# EAGLE design automator (EAGLE 4.16)
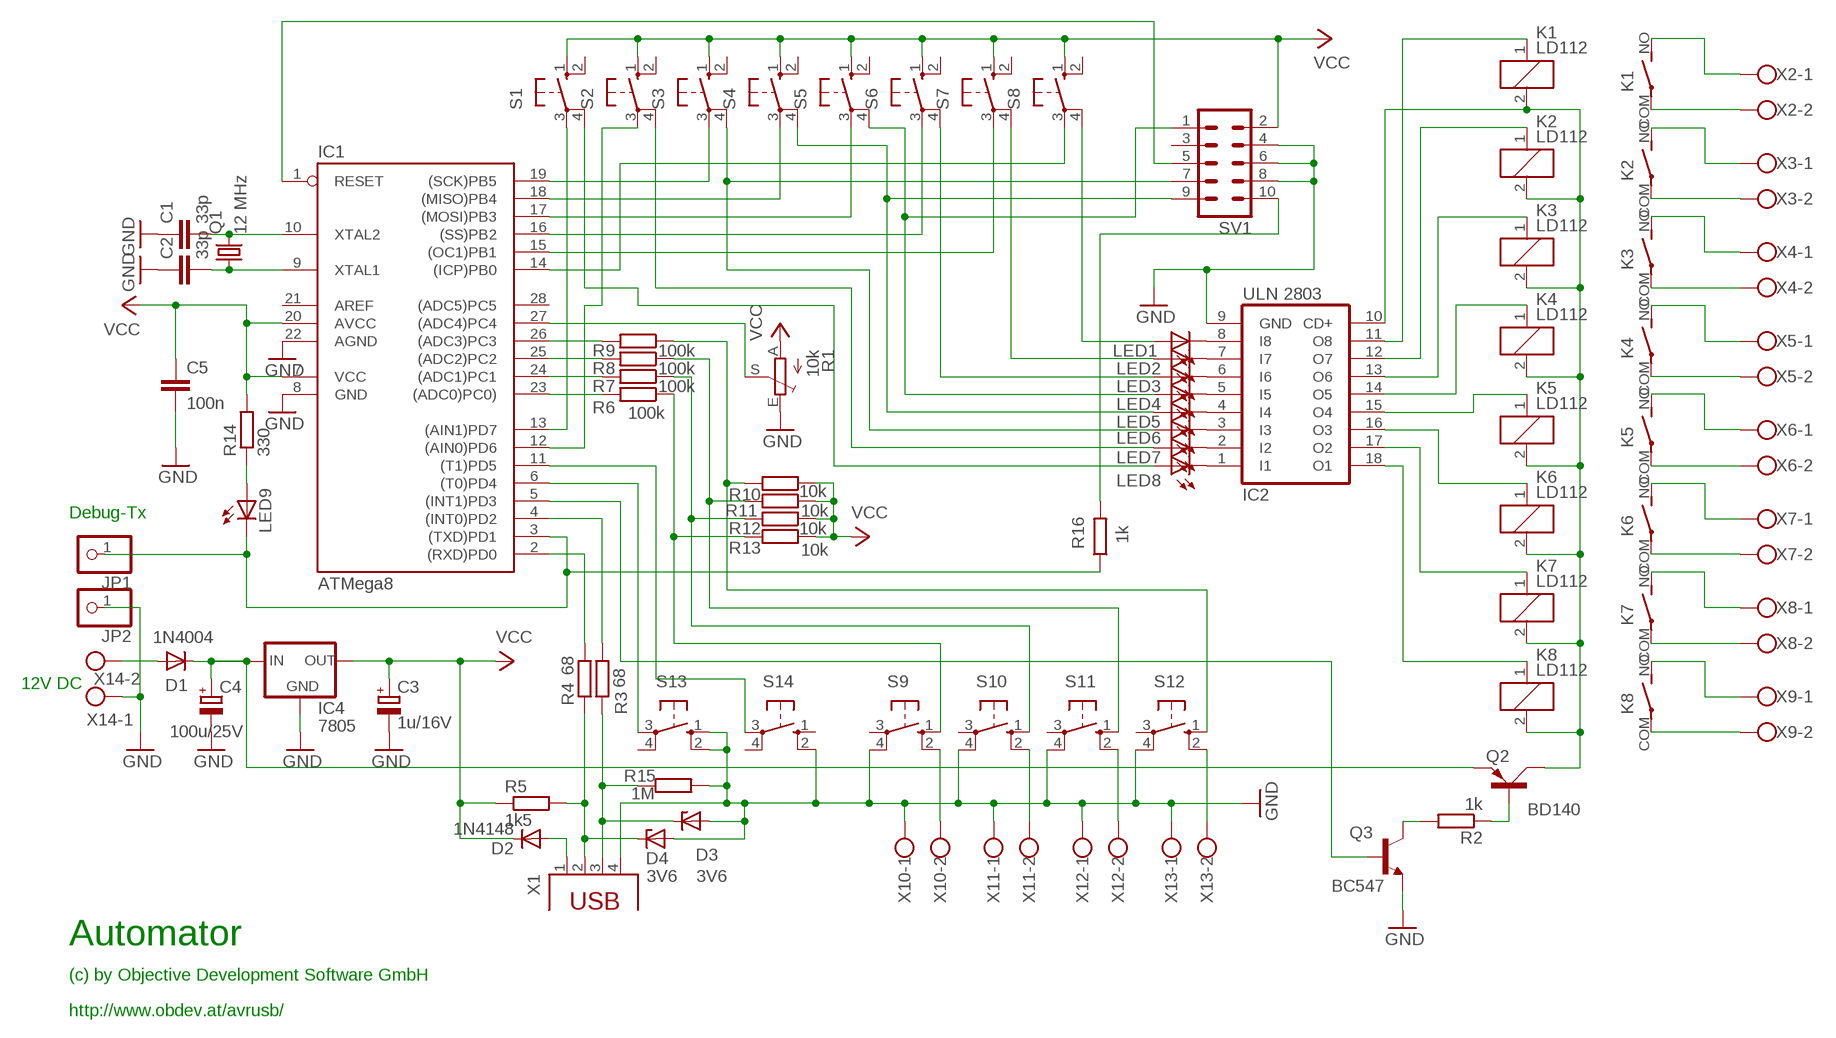
[diagram p0: schematic, sheet 1]

## Parts
C1  33p  C-EU025-024X044  [C025-024X044]
C2  33p  C-EU025-024X044  [C025-024X044]
C3  1u/16V  CPOL-EUE2.5-6  [E2,5-6]
C4  100u/25V  CPOL-EUE2.5-6  [E2,5-6]
C5  100n  C-EU050-025X075  [C050-025X075]
D1  1N4004  [DO41-10]
D2  1N4148  [DO35-10]
D3  3V6  ZENER-DIODEDO34-7  [DO34Z7]
D4  3V6  ZENER-DIODEDO34-7  [DO34Z7]
IC1  ATMega8  AT90S4433P  [DIL28-3]
IC2  ULN 2803  ULN2803A  [DIL18]
IC4  7805  78XXS  [78XXS]
JP1  PINHD-1X1  [1X01]
JP2  PINHD-1X1  [1X01]
K1  LD112  [LD]
K2  LD112  [LD]
K3  LD112  [LD]
K4  LD112  [LD]
K5  LD112  [LD]
K6  LD112  [LD]
K7  LD112  [LD]
K8  LD112  [LD]
LED1  LED3MM  [LED3MM]
LED2  LED3MM  [LED3MM]
LED3  LED3MM  [LED3MM]
LED4  LED3MM  [LED3MM]
LED5  LED3MM  [LED3MM]
LED6  LED3MM  [LED3MM]
LED7  LED3MM  [LED3MM]
LED8  LED3MM  [LED3MM]
LED9  LED3MM  [LED3MM]
Q1  12 MHz  CRYTALHC49S  [HC49/S]
Q2  BD140  [TO126AV]
Q3  BC547  [TO92]
R1  10k  TRIM_EU-CA6V  [CA6V]
R2  1k  R-EU_0207/10  [0207/10]
R3  68  R-EU_0207/10  [0207/10]
R4  68  R-EU_0207/10  [0207/10]
R5  1k5  R-EU_0207/10  [0207/10]
R6  100k  R-EU_0207/10  [0207/10]
R7  100k  R-EU_0207/10  [0207/10]
R8  100k  R-EU_0207/10  [0207/10]
R9  100k  R-EU_0207/10  [0207/10]
R10  10k  R-EU_0207/10  [0207/10]
R11  10k  R-EU_0207/10  [0207/10]
R12  10k  R-EU_0207/10  [0207/10]
R13  10k  R-EU_0207/10  [0207/10]
R14  330  R-EU_0207/10  [0207/10]
R15  1M  R-EU_0207/10  [0207/10]
R16  1k  R-EU_0207/10  [0207/10]
S1  10-XX  [B3F-10XX]
S2  10-XX  [B3F-10XX]
S3  10-XX  [B3F-10XX]
S4  10-XX  [B3F-10XX]
S5  10-XX  [B3F-10XX]
S6  10-XX  [B3F-10XX]
S7  10-XX  [B3F-10XX]
S8  10-XX  [B3F-10XX]
S9  10-XX  [B3F-10XX]
S10  10-XX  [B3F-10XX]
S11  10-XX  [B3F-10XX]
S12  10-XX  [B3F-10XX]
S13  10-XX  [B3F-10XX]
S14  10-XX  [B3F-10XX]
SV1  ML10  [ML10]
X1  PN61729  [PN61729]
X2  W237-102  [W237-102]
X3  W237-102  [W237-102]
X4  W237-102  [W237-102]
X5  W237-102  [W237-102]
X6  W237-102  [W237-102]
X7  W237-102  [W237-102]
X8  W237-102  [W237-102]
X9  W237-102  [W237-102]
X10  W237-102  [W237-102]
X11  W237-102  [W237-102]
X12  W237-102  [W237-102]
X13  W237-102  [W237-102]
X14  W237-102  [W237-102]

## Nets
GND: C1.1 C2.1 C3.- C4.- C5.2 D3.A D4.A IC1.8(GND) IC1.22(AGND) IC2.9(GND) IC4.GND JP2.1 Q3.1(E) R1.E R15.2 S9.4(P1) S10.4(P1) S11.4(P1) S12.4(P1) S13.1(S) S13.2(S1) S14.2(S1) SV1.4 SV1.6 SV1.8 X1.4 X10.1 X11.1 X12.1 X13.1 X14.1
N$1: C1.2 IC1.10(XTAL2) Q1.2
N$2: C2.2 IC1.9(XTAL1) Q1.1
N$3: D1.A X14.2
N$4: C4.+ D1.C IC4.IN Q2.E
N$5: LED8.A S1.4(P1)
N$6: IC1.27((ADC4)PC4) R1.S
N$7: LED7.A S2.4(P1)
N$8: LED6.A S3.4(P1) SV1.7
N$9: LED5.A S4.4(P1) SV1.9
N$10: IC1.13((AIN1)PD7) S1.3(P)
N$11: IC1.12((AIN0)PD6) S2.3(P)
N$12: IC1.19((SCK)PB5) S3.3(P)
N$13: IC1.18((MISO)PB4) S4.3(P)
N$14: IC2.8(I8) LED1.K(C)
N$15: IC2.7(I7) LED2.K(C)
N$16: IC2.6(I6) LED3.K(C)
N$17: IC2.5(I5) LED4.K(C)
N$18: IC2.4(I4) LED5.K(C)
N$19: IC2.3(I3) LED6.K(C)
N$20: IC2.2(I2) LED7.K(C)
N$21: IC2.1(I1) LED8.K(C)
N$22: IC1.17((MOSI)PB3) S5.3(P)
N$23: IC1.16((SS)PB2) S6.3(P)
N$24: IC1.15((OC1)PB1) S7.3(P)
N$25: IC1.14((ICP)PB0) S8.3(P)
N$26: LED4.A S5.4(P1) SV1.1
N$27: LED3.A S6.4(P1)
N$28: LED2.A S7.4(P1)
N$29: LED1.A S8.4(P1)
N$30: IC2.10(CD+) K1.2 K2.2 K3.2 K4.2 K5.2 K6.2 K7.2 K8.2 Q2.C
N$31: IC2.18(O1) K8.1
N$32: IC2.17(O2) K7.1
N$33: IC2.16(O3) K6.1
N$34: IC2.11(O8) K1.1
N$35: D2.A X1.1
N$36: IC2.12(O7) K2.1
N$37: IC2.13(O6) K3.1
N$38: IC2.14(O5) K4.1
N$39: Q3.3(C) R2.2
N$40: Q2.B R2.1
N$41: S9.2(S1) X10.2
N$42: S10.2(S1) X11.2
N$43: S11.2(S1) X12.2
N$44: S12.2(S1) X13.2
N$45: D4.C R4.1 R5.2 X1.2
N$46: D3.C R3.1 R15.1 X1.3
N$47: IC1.23((ADC0)PC0)) R6.2
N$48: IC1.2((RXD)PD0) R4.2
N$49: IC1.4((INT0)PD2) R3.2
N$50: IC1.24((ADC1)PC1) R7.2
N$51: IC1.25((ADC2)PC2) R8.2
N$52: IC1.26((ADC3)PC3) R9.2
N$53: R6.1 R13.2 S9.1(S)
N$54: R7.1 R12.2 S10.1(S)
N$55: R8.1 R11.2 S11.1(S)
N$56: R9.1 R10.2 S12.1(S)
N$57: IC1.3((TXD)PD1) JP1.1 LED9.K(C) R16.1
N$58: IC1.5((INT1)PD3) Q3.2(B)
N$59: IC1.6((T0)PD4) S13.3(P)
N$60: IC1.11((T1)PD5) S14.3(P)
N$61: LED9.A R14.1
N$62: K8.COM(2:P) X9.2
N$63: K7.COM(2:P) X8.2
N$64: K6.COM(2:P) X7.2
N$65: K5.COM(2:P) X6.2
N$66: K4.COM(2:P) X5.2
N$67: K3.COM(2:P) X4.2
N$68: K2.COM(2:P) X3.2
N$69: K1.COM(2:P) X2.2
N$70: K8.NO(2:S) X9.1
N$71: K7.NO(2:S) X8.1
N$72: K6.NO(2:S) X7.1
N$73: K5.NO(2:S) X6.1
N$74: K4.NO(2:S) X5.1
N$75: K3.NO(2:S) X4.1
N$76: K2.NO(2:S) X3.1
N$77: K1.NO(2:S) X2.1
N$78: IC2.15(O4) K5.1
N$81: IC1.1(RESET) SV1.5
N$83: R16.2 SV1.10
VCC: C3.+ C5.1 D2.C IC1.7(VCC) IC1.20(AVCC) IC4.OUT R1.A R5.1 R10.1 R11.1 R12.1 R13.1 R14.2 S1.1(S) S2.1(S) S3.1(S) S4.1(S) S5.1(S) S6.1(S) S7.1(S) S8.1(S) SV1.2
Unconnected: IC1.28((ADC5)PC5) S1.2(S1) S2.2(S1) S3.2(S1) S4.2(S1) S5.2(S1) S6.2(S1) S7.2(S1) S8.2(S1) S9.3(P) S10.3(P) S11.3(P) S12.3(P) S13.4(P1) S14.1(S) S14.4(P1) SV1.3

## Notes on the sheet
- Debug-Tx
- 12V DC
- Automator
- (c) by Objective Development Software GmbH
- http://www.obdev.at/avrusb/

## Power pins joined to a net without a drawn wire
AREF: IC1.21(AREF)

## Library data of the parts
C1 C2 C5 = rcl:C-EU: CAPACITOR, European symbol
C3 C4 = rcl:CPOL-EU: POLARIZED CAPACITOR, European symbol
D1 = diode:1N4004: DIODE general purpose rectifier, 1 A
D2 = diode:1N4148: DIODE high speed (Philips)
D3 D4 = diode:ZENER-DIODE: Z-Diode
IC1 = atmel:AT90S4433: MICROCONTROLLER 4 Kbytes FLASH 128 bytes SRAM 256 bytes EEPROM UART 6-channel 10 bit ADC
IC2 = uln-udn:ULN2803A: DRIVER ARRAY
IC4 = v-reg:78XXS: VOLTAGE REGULATOR
JP1 JP2 = pinhead:PINHD-1X1: PIN HEADER
K1-K8 = relay:LD?*: Slim Power Relay NAiS Source: http://www.mew-europe.com/.. en_ds_61112_0000.pdf
LED1-LED9 = led:LED: LED OSRAM: - CHIPLED LG R971, LG N971, LY N971, LG Q971, LY Q971, LO R971, LY R971 LH N974, LH R974 LS Q976, LO Q976, LY Q976 LO Q996 - Hyper CHIPLED LW Q18S LB Q993, LB Q99A, LB R99A - SideLED LS A670, LO A670, LY A670, LG A670, LP A670 LB A673, LV A673, LT A673, LW A673 LH A674 LY A675 LS A676, LA A676, LO A676, LY A676, LW A676 LS A679, LY A679, LG A679 - Hyper Micro SIDELED® LS Y876, LA Y876, LO Y876, LY Y876 LT Y87S - SmartLED LW L88C, LW L88S LB L89C, LB L89S, LG L890 LS L89K, LO L89K, LY L89K LS L896, LA L896, LO L896, LY L896 - TOPLED LS T670, LO T670, LY T670, LG T670, LP T670 LSG T670, LSP T670, LSY T670, LOP T670, LYG T670 LG T671, LOG T671, LSG T671 LB T673, LV T673, LT T673, LW T673 LH T674 LS T676, LA T676, LO T676, LY T676, LB T676, LH T676, LSB T676, LW T676 LB T67C, LV T67C, LT T67C, LS T67K, LO T67K, LY T67K, LW E67C LS E67B, LA E67B, LO E67B, LY E67B, LB E67C, LV E67C, LT E67C LW T67C LS T679, LY T679, LG T679 LS T770, LO T770, LY T770, LG T770, LP T770 LB T773, LV T773, LT T773, LW T773 LH T774 LS E675, LA E675, LY E675, LS T675 LS T776, LA T776, LO T776, LY T776, LB T776 LHGB T686 LT T68C, LB T68C - Hyper Mini TOPLED® LB M676 - Mini TOPLED Santana® LG M470 LS M47K, LO M47K, LY M47K Source: http://www.osram.convergy.de/
Q1 = crystal:CRYTAL: CRYSTAL
Q2 = transistor-power:BD140: PNP TRANSISTOR
Q3 = transistor-npn:BC547*: NPN Transistor
R1 = pot:TRIM_EU-: POTENTIOMETER
R2-R16 = rcl:R-EU_: RESISTOR, European symbol
S1-S14 = switch-omron:10-XX: OMRON SWITCH
SV1 = con-harting-ml:ML10: HARTING
X1 = con-berg:PN61729: BERG USB connector
X2-X14 = con-wago-500:W237-102: WAGO SCREW CLAMP

## Board
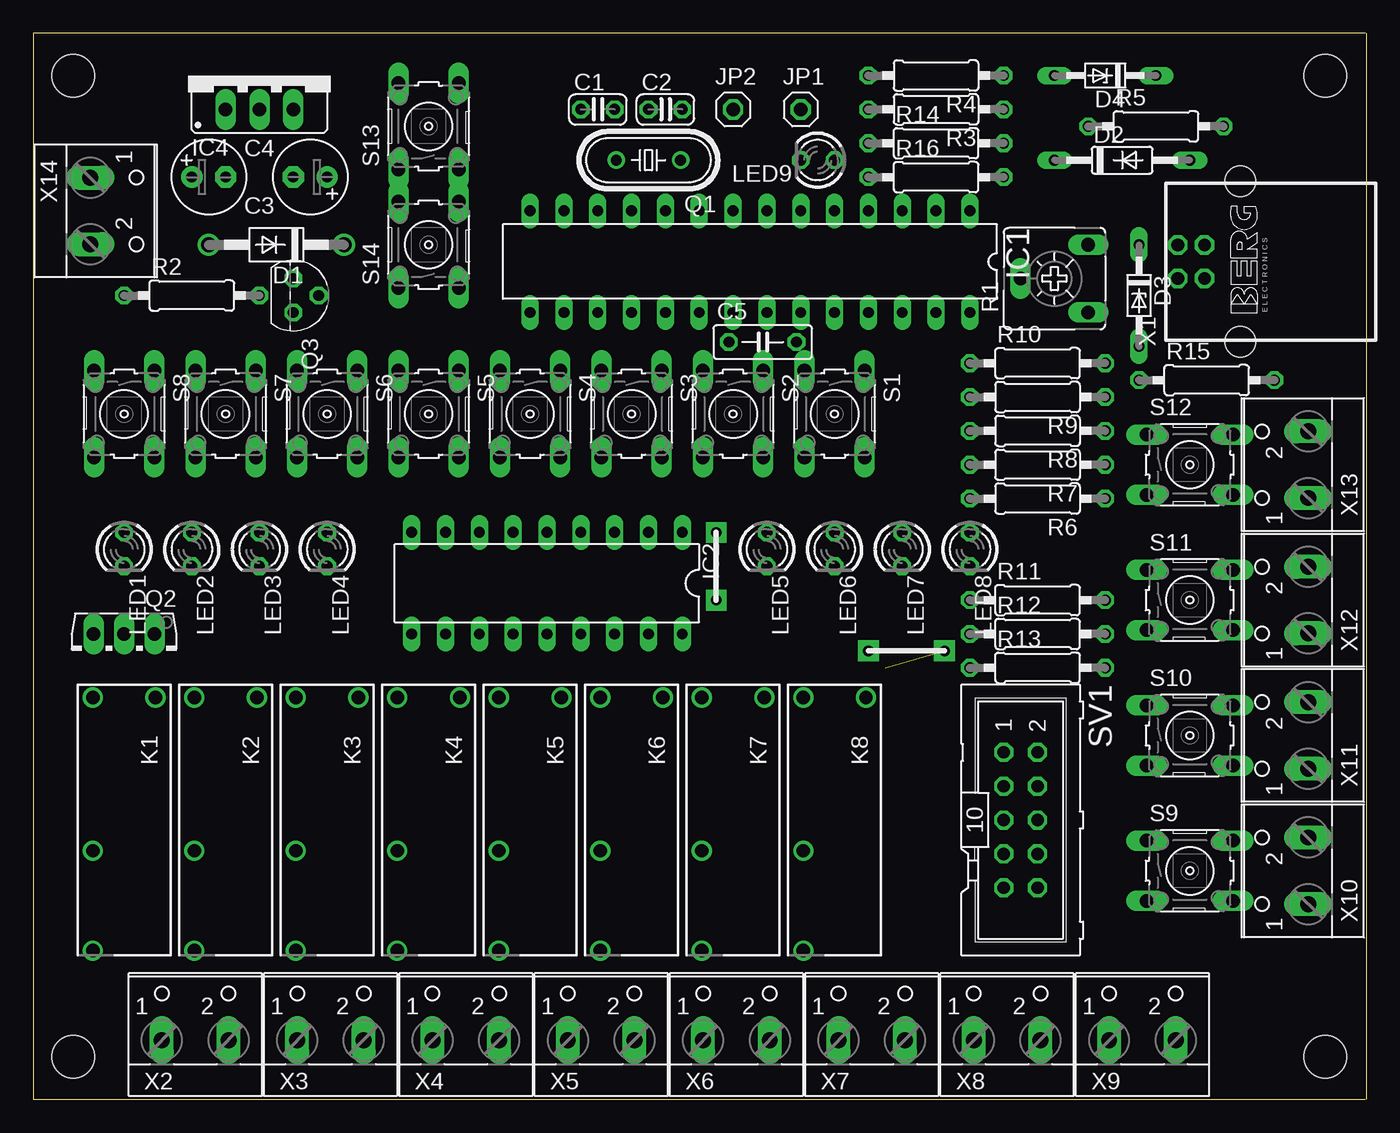
[diagram p1: board, top side]
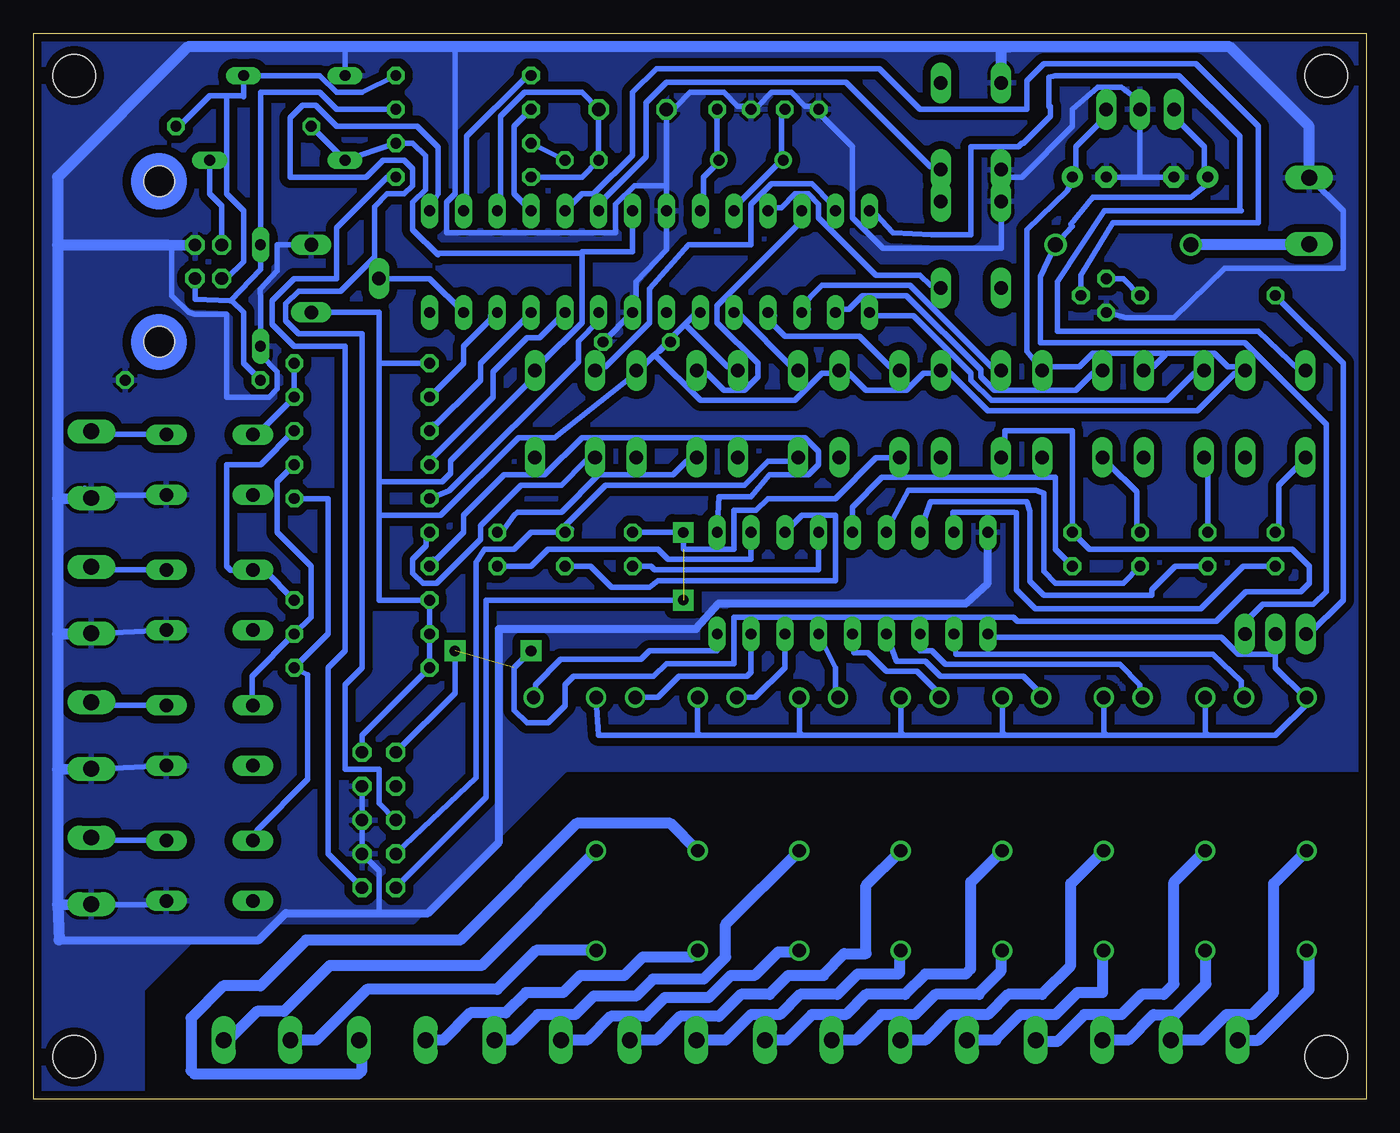
[diagram p2: board, bottom side, seen from below]

Size 100.08 x 80 mm. Coordinates in mm from the lower left corner, seen from the top.
Outline: 100,0 0,0 0,80 100,80
Outline: 100.08,80 100.08,0
Copper layers 16: Bottom 0.035mm
Design rules "default": minimum track width 16mil, minimum drill 31mil, track to track 8mil, track to pad 8mil, pad to pad 8mil, via to via 12mil, smd to smd 8mil, copper to edge 20mil, drill to drill 8mil, minimum pad ring 10mil, minimum via ring 15mil, stop-mask expansion 4mil, vias tented up to drill 0mil, thermal gap 10mil
Holes 3.2 mm at 3.01,3.17 96.99,3.17 96.99,76.83 3.01,76.83

### Footprints (pad centres in the part's own frame; a part is rotated, then mirrored left to right if it is on the bottom)
C025-024X044 = drill 0.813 octagon: 1 -1.27,0; 2 1.27,0
E2,5-6 = drill 0.813 pad 1.6 round: + -1.27,0 | drill 0.813 pad 1.6 octagon: - 1.27,0
C050-025X075 = drill 0.813 octagon: 1 -2.54,0; 2 2.54,0
DO41-10 = drill 1.118 round: A 5.08,0; C -5.08,0
DO35-10 = drill 0.813 long: A 5.08,0; C -5.08,0
DO34Z7 = drill 0.813 long: A 3.81,0; C -3.81,0
DIL28-3 = drill 0.813 long: 1 -16.51,-3.81; 2 -13.97,-3.81; 3 -11.43,-3.81; 4 -8.89,-3.81; 5 -6.35,-3.81; 6 -3.81,-3.81; 7 -1.27,-3.81; 8 1.27,-3.81; 9 3.81,-3.81; 10 6.35,-3.81; 11 8.89,-3.81; 12 11.43,-3.81; 13 13.97,-3.81; 14 16.51,-3.81; 15 16.51,3.81; 16 13.97,3.81; 17 11.43,3.81; 18 8.89,3.81; 19 6.35,3.81; 20 3.81,3.81; 21 1.27,3.81; 22 -1.27,3.81; 23 -3.81,3.81; 24 -6.35,3.81; 25 -8.89,3.81; 26 -11.43,3.81; 27 -13.97,3.81; 28 -16.51,3.81
DIL18 = drill 0.813 long: 1 -10.16,-3.81; 2 -7.62,-3.81; 3 -5.08,-3.81; 4 -2.54,-3.81; 5 0,-3.81; 6 2.54,-3.81; 7 5.08,-3.81; 8 7.62,-3.81; 9 10.16,-3.81; 10 10.16,3.81; 11 7.62,3.81; 12 5.08,3.81; 13 2.54,3.81; 14 0,3.81; 15 -2.54,3.81; 16 -5.08,3.81; 17 -7.62,3.81; 18 -10.16,3.81
78XXS = drill 1.016 long: GND 0,-2.54; IN -2.54,-2.54; OUT 2.54,-2.54
1X01 = drill 1.016 octagon: 1 0,0
LD = drill 1 round: 1 -9.2,2.35; 2 -9.2,-2.35; COM 2.3,-2.35; NO 9.8,-2.35
LED3MM = drill 0.813 octagon: A -1.27,0; K 1.27,0
HC49/S = drill 0.813 round: 1 -2.413,0; 2 2.413,0
TO126AV = drill 1.016 long: B 2.286,-1.27; C 0,-1.27; E -2.286,-1.27
TO92 = drill 0.813 octagon: 1 1.27,0; 2 0,1.905; 3 -1.27,0
CA6V = drill 1.016 long: A -2.54,-2.54; E 2.54,-2.54; S 0,2.54
0207/10 = drill 0.813 octagon: 1 -5.08,0; 2 5.08,0
B3F-10XX = drill 1.016 long: 1 -3.251,2.261; 2 3.251,2.261; 3 -3.251,-2.261; 4 3.251,-2.261
ML10 = drill 0.914 octagon: 1 -5.08,-1.27; 2 -5.08,1.27; 3 -2.54,-1.27; 4 -2.54,1.27; 5 0,-1.27; 6 0,1.27; 7 2.54,-1.27; 8 2.54,1.27; 9 5.08,-1.27; 10 5.08,1.27
PN61729 = drill 0.95 octagon: 1 1.25,4.71; 2 -1.25,4.71; 3 -1.25,2.71; 4 1.25,2.71 | hole 2.3: -6.02,0; 6.02,0
W237-102 = drill 1.194 long: 1 -2.5,-1.27; 2 2.5,-1.27

### Placement (x,y rotation side)
C1  42.38,74.29 0 top
C2  47.46,74.29 0 top
C3  20.79,69.21 180 top
C4  13.17,69.21 0 top
C5  54.76,56.83 0 top
D1  18.25,64.13 180 top
D2  81.75,70.48 0 top
D3  83.02,60.32 270 top
D4  80.48,76.83 180 top
IC1  53.81,62.86 180 top
IC2  38.57,38.73 180 top
IC4  16.98,76.83 0 top
JP1  57.62,74.29 0 top
JP2  52.54,74.29 0 top
K1  6.82,20.95 270 top
K2  14.44,20.95 270 top
K3  22.06,20.95 270 top
K4  29.68,20.95 270 top
K5  37.3,20.95 270 top
K6  44.92,20.95 270 top
K7  52.54,20.95 270 top
K8  60.16,20.95 270 top
LED1  6.82,41.27 270 top
LED2  11.9,41.27 270 top
LED3  16.98,41.27 270 top
LED4  22.06,41.27 270 top
LED5  55.08,41.27 270 top
LED6  60.16,41.27 270 top
LED7  65.24,41.27 270 top
LED8  70.32,41.27 270 top
LED9  58.89,70.48 180 top
Q1  46.19,70.48 180 top
Q2  6.82,33.65 180 top
Q3  19.52,60.32 270 top
R1  76.67,61.59 90 top
R2  11.9,60.32 0 top
R3  67.78,74.29 180 top
R4  67.78,76.83 180 top
R5  84.29,73.02 0 top
R6  75.4,45.08 180 top
R7  75.4,47.62 180 top
R8  75.4,50.16 180 top
R9  75.4,52.7 180 top
R10  75.4,55.24 0 top
R11  75.4,37.46 0 top
R12  75.4,34.92 0 top
R13  75.4,32.38 0 top
R14  67.78,71.75 0 top
R15  88.1,53.97 0 top
R16  67.78,69.21 0 top
S1  60.16,51.43 270 top
S2  52.54,51.43 270 top
S3  44.92,51.43 270 top
S4  37.3,51.43 270 top
S5  29.68,51.43 270 top
S6  22.06,51.43 270 top
S7  14.44,51.43 270 top
S8  6.82,51.43 270 top
S9  86.83,17.14 0 top
S10  86.83,27.3 0 top
S11  86.83,37.46 0 top
S12  86.83,47.62 0 top
S13  29.68,73.02 90 top
S14  29.68,64.13 90 top
SV1  74.13,20.95 270 top
X1  90.64,62.86 90 top
X2  12.15,5.71 0 top
X3  22.31,5.71 0 top
X4  32.47,5.71 0 top
X5  42.63,5.71 0 top
X6  52.79,5.71 0 top
X7  62.95,5.71 0 top
X8  73.11,5.71 0 top
X9  83.27,5.71 0 top
X10  94.45,17.14 90 top
X11  94.45,27.3 90 top
X12  94.45,37.46 90 top
X13  94.45,47.62 90 top
X14  5.55,66.67 270 top

### Tracks (layer width: path | path; a pad name or v marks a point on that pad's centre or on a via)
GND
  Bottom 0.406: 16.98,69.21 C4.- | 16.98,69.21 C3.- | 16.98,69.21 IC4.GND 16.47,74.54 18.38,75.94 20.15,75.94 22.06,74.29 22.06,73.02 25.87,69.21 27.14,69.21 | S12.4 90.64,45.33 94.96,45.33 X13.1 96.23,45.84 | X10.1 94.96,14.6 90.64,14.6 S9.4 | 27.14,69.21 27.39,68.96 27.39,63.88 36.28,63.88 38.57,66.16 38.57,71.5 40.86,73.78 C1.1 41.62,74.54 42.13,74.54 43.14,75.56 44.67,75.56 45.68,74.54 C2.1 46.7,74.54 47.21,74.54 48.22,75.56 50.76,75.56 51.78,74.54 JP2.1 52.54,68.57 | S13.1 27.42,69.49 27.14,69.21 | S14.2 27.42,68.93 27.14,69.21 | C5.2 IC1.22 54.83,59.56 54.83,61.34 52.54,63.75 IC1.8 52.54,68.57 | Q3.1 18,58.67 14.44,58.67 10.63,62.35 1.74,62.35 1.74,66.67 4.28,69.21 | 52.54,68.57 54.95,68.57 56.35,67.18 56.35,65.02 69.05,65.02 69.05,67.3 68.41,67.94 68.41,78.99 | X11.1 95.72,24.76 S10.4 | X12.1 95.72,34.92 S11.4 | R1.E 81.75,64.13 81.75,62.16 83.05,60.8 83.02,60 D3.A 83.02,55.88 81.75,54.61 81.75,53.34 82.39,52.7 85.56,52.7 85.56,58.92 87.97,58.92 88.42,59.05 89.69,60.32 89.69,63.81 90,64.13 90,64.11 | 76.67,79.05 76.67,78.99 D4.A | SV1.6 SV1.8 74.13,17.14 74.13,13.97 | SV1.6 SV1.4 SV1.6
  Bottom 0.61: 98.13,11.93 83.15,11.93 81.11,13.97 74.13,13.97 70.45,13.97 65.11,19.3 65.11,35.3 50.32,35.3 48.6,37.21 30.06,37.21 28.41,38.73 IC2.9
  Bottom 0.813: X14.1 4.28,69.21 4.28,73.02 10.25,78.99 26.76,78.99 | 26.76,78.99 68.41,78.99 76.67,78.99 88.48,78.99 98.26,69.21 98.26,64.13 | S13.2 27.42,78.84 26.76,78.99 | 98.26,14.6 X10.1 | 98.26,64.13 98.26,45.08 | 98.26,45.08 98.26,34.92 | 98.26,34.92 98.26,24.76 | 98.26,24.76 98.26,14.6 | 98.26,64.13 90,64.11 X1.4 | 98.26,24.76 X11.1 | 98.26,34.92 95.72,34.92 | 98.26,45.08 X13.1 | 98.26,14.6 98.13,11.93
  pour Bottom (isolate 0.61): 0.47,79.37 99.53,79.37 99.53,0.63 91.91,0.63 91.91,8.25 88.1,12.06 83.02,12.06 81.75,13.33 71.59,13.33 70.32,14.6 60.16,24.76 0.47,24.76
N$1
  Bottom 0.406: C1.2 43.9,73.78 43.9,70.99 Q1.2 44.16,70.23 47.21,67.18 IC1.10
N$2
  Bottom 0.406: C2.2 48.73,70.99 Q1.1 48.98,69.97 49.75,69.21 49.75,67.18 IC1.9
N$3
  Bottom 0.406: X14.2 5.04,64.13
  Bottom 0.813: 5.04,64.13 D1.A
N$4
  Bottom 0.406: IC4.IN 14.19,73.53 12.15,71.5 12.15,69.97 C4.+ 11.9,68.7 13.17,67.69 20.54,67.69 22.19,65.65 22.06,65.53 D1.C 24.47,61.72 24.47,56.76 9.11,56.76 3.01,50.67 3.01,38.73 | 3.01,38.73 3.01,38.22 | Q2.E 9.04,34.98 9.04,35.87 7.77,37.14 3.96,37.14 3.01,38.1 3.01,38.73
N$5
  Bottom 0.406: LED8.A 70.57,42.03 70.57,41.52 71.59,40.51 71.59,39.49 70.83,38.73 69.81,38.73 66.51,42.03 66.51,43.05 63.46,46.1 60.41,46.1 58.64,47.87 S1.4
N$6
  Bottom 0.406: R1.S 70.32,61.59 IC1.27
N$7
  Bottom 0.406: LED7.A 64.73,42.79 63.97,43.81 63.72,44.06 60.41,44.06 57.62,46.86 52.03,46.86 51.02,47.87 S2.4
N$8
  Bottom 0.406: S3.4 43.4,47.87 44.92,47.87 46.7,46.1 57.11,46.1 60.41,42.79 59.65,42.79 LED6.A 62.7,42.54 63.97,41.27 66.19,41.27 66.83,40.32 66.83,24.12 SV1.7
N$9  (1 unrouted)
  Bottom 0.406: LED5.A 51.27,42.54 51.27,41.27 47.46,41.27 47.46,44.19 45.81,44.19 44.92,45.08 39.84,45.08 36.79,48.13 35.09,48.13 S4.4 | SV1.9 66.07,22.66 66.07,37.46 51.27,37.46
N$10
  Bottom 0.406: IC1.13 40.09,67.18 41.62,68.7 44.67,68.7 46.19,67.18 46.19,64.13 50.89,64.13 53.81,60.83 53.81,58.29 57.11,54.99 S1.3
N$11
  Bottom 0.406: IC1.12 42.63,66.16 42.63,65.65 48.73,59.56 48.73,58.29 45.68,55.24 45.68,54.22 46.7,53.21 48.22,53.21 49.49,54.48 S2.3
N$12
  Bottom 0.406: IC1.19 46.95,58.8 43.14,54.99 S3.3
N$13
  Bottom 0.406: IC1.18 44.41,58.8 45.17,58.8 43.65,57.27 38.06,57.27 35.78,54.99 S4.3
N$14
  Bottom 0.406: LED1.K 9.23,40 12.41,36.83 24.85,36.83 26.25,38.22 26.25,44 26.44,44.06 31.01,44.06 30.95,43.05 IC2.8
N$15
  Bottom 0.406: LED2.K 14.31,40 16.09,38.22 16.09,37.84 24.22,37.84 25.23,38.86 25.23,44.13 25.49,44.83 32.73,44.83 IC2.7
N$16
  Bottom 0.406: LED3.K 18.25,38.73 23.33,38.73 24.22,39.62 24.22,45.46 24.79,45.72 34.38,45.72 36.03,42.67 IC2.6
N$17
  Bottom 0.406: LED4.K 23.33,41.27 23.33,46.67 36.35,46.67 38.57,44.45 IC2.5
N$18
  Bottom 0.406: LED5.K 53.68,40 53.43,39.75 41.11,39.75 IC2.4
N$19
  Bottom 0.406: LED6.K 58.25,40 56.67,38.41 53.81,38.41 53.17,38.92 39.84,38.92 39.84,43.81 42.38,43.81 IC2.3
N$20
  Bottom 0.406: LED7.K 62.7,40 61.43,41.27 53.17,41.27 52.41,40.51 46.19,40.51 IC2.2
N$21
  Bottom 0.406: IC2.1 48.6,45.21 46.19,45.21 44.79,46.86 41.87,46.86 41.11,47.62 41.11,48.64 42.13,49.65 58.89,49.65 61.68,46.86 64.73,46.86 67.78,43.81 67.78,42.54 LED8.K 70.07,40.51
N$22
  Bottom 0.406: IC1.17 41.87,59.3 42.63,59.3 40.86,61.08 34.25,61.08 28.16,54.99 S5.3
N$23
  Bottom 0.406: IC1.16 39.33,59.3 38.82,59.3 37.81,60.32 34.51,60.32 28.92,54.73 28.92,54.22 27.9,53.21 21.81,53.21 20.54,54.48 S6.3
N$24
  Bottom 0.406: IC1.15 36.79,58.8 34,58.8 29.68,54.48 29.68,53.97 28.16,52.45 14.95,52.45 12.92,54.48 S7.3
N$25
  Bottom 0.406: IC1.14 36.79,66.42 35.52,65.02 32.6,64.89 29.68,64.89 29.68,71.5 26.12,71.5 25.87,71.75 25.74,71.75 23.71,73.78 23.71,74.42 | 9.49,66.67 9.49,72.26 14.06,76.83 23.33,76.83 23.84,76.7 23.84,74.54 23.71,74.42 | 23.71,74.42 23.71,74.54 | S8.3 4.99,54.68 8.09,57.65 23.2,57.65 23.2,61.34 19.65,66.67 9.49,66.67 | 9.49,66.67 9.36,66.67
N$26  (1 unrouted)
  Bottom 0.406: SV1.1 68.41,30.47 68.41,33.65 | S5.4 27.42,48.22 27.46,48.26 27.14,48.57 27.14,50.16 22.06,50.16 LED4.A 20.79,41.27 5.55,41.27 4.28,40 4.28,38.73 4.92,38.1 9.04,38.1 11.27,35.87 26.19,35.87 26.5,36.19 47.46,36.19 47.46,32.7 52.54,32.7 53.49,31.74 59.52,31.74 60.16,31.11 60.16,29.52 61.43,28.25 63.02,28.25 63.97,29.2 63.97,32.38 62.7,33.65
N$27
  Bottom 0.406: LED3.A 17.23,43.05 17.23,45.59 19.27,47.62 S6.4
N$28
  Bottom 0.406: LED2.A 11.9,47.62 S7.4
N$29
  Bottom 0.406: LED1.A 6.57,43.05 6.57,46.1 5.04,47.62 S8.4
N$30
  Bottom 0.406: K8.2 57.81,30.03 57.62,27.3 50,27.3 | 11.9,27.3 6.82,27.3 4.28,29.84 4.47,30.03 K1.2 4.59,30.15 6.82,32.38 6.82,33.4 | 11.9,27.3 19.52,27.3 | 19.52,27.3 27.14,27.3 | 27.14,27.3 34.76,27.3 | 34.76,27.3 42.38,27.3 | 42.38,27.3 50,27.3 | 6.82,33.4 Q2.C | K2.2 12.09,27.49 11.9,27.3 | K3.2 19.71,27.49 19.52,27.3 | K4.2 27.33,27.49 27.14,27.3 | K5.2 34.95,27.49 34.76,27.3 | K6.2 42.57,27.49 42.38,27.3 | K7.2 50.19,27.49 50,27.3 | 6.82,33.4 9.61,33.4 10.88,34.67 27.9,34.67 IC2.10
N$31
  Bottom 0.406: IC2.18 48.73,33.65 53.81,33.65 54.45,33.02 60.48,33.02 62.38,31.11 62.38,30.16 K8.1
N$32
  Bottom 0.406: IC2.17 46.19,32.06 46.51,31.74 51.59,31.74 53.17,30.16 K7.1
N$33
  Bottom 0.406: IC2.16 43.65,32.38 45.87,30.16 K6.1 | K6.1 47.46,30.16 | K6.1
N$34
  Bottom 0.406: IC2.11 30.82,33.4 11.52,33.4 9.36,31.36 9.36,29.96 | 9.36,29.96 9.36,29.84 | K1.1 9.36,29.96
N$35
  Bottom 0.406: X1.1 85.93,67.04 86.83,67.94 D2.A
N$36
  Bottom 0.406: IC2.12 33.49,33.65 32.6,33.65 31.58,32.63 18.5,32.63 16.98,31.11 16.98,29.96 | 16.98,29.96 16.98,29.84 | K2.1 16.98,29.96
N$37
  Bottom 0.406: IC2.13 35.27,32.89 33.11,32.89 31.97,31.74 25.74,31.74 24.6,30.6 24.6,29.96 | 24.6,29.96 24.6,29.84 | K3.1 24.6,29.96
N$38
  Bottom 0.406: IC2.14 38.44,33.52 37.43,33.52 36.03,32.13 33.74,32.13 32.22,30.6 32.22,30.34 K4.1
N$39
  Bottom 0.406: R2.2 18.25,61.59 Q3.3
N$40
  Bottom 0.406: R2.1 1.74,55.24 1.74,37.46 4.28,34.92 Q2.B
N$41
  Bottom 0.406: S9.2 90.64,19.43 94.96,19.43 X10.2
N$42
  Bottom 0.406: S10.2 90.64,29.59 94.96,29.59 X11.2
N$43
  Bottom 0.406: S11.2 90.64,39.75 94.96,39.75 X12.2
N$44
  Bottom 0.406: S12.2 90.64,49.91 94.96,49.91 X13.2
N$45
  Bottom 0.406: 85.56,75.31 84.29,75.31 | 85.56,75.31 86.83,75.31 88.86,73.27 R5.2 | X1.2 85.54,61.61 84.29,62.86 84.29,66.67 85.56,67.94 85.56,75.31 | 84.29,75.31 84.29,75.24 | 84.29,75.31 D4.C 78.58,76.83 77.3,75.56 75.4,75.56 R4.1
N$46
  Bottom 0.406: X1.3 87.93,60.02 85.31,59.94 | 85.31,59.94 85.24,59.94 83.02,62.29 D3.C 83.02,75.56 78.58,75.56 77.3,74.29 R3.1 | R15.1 84.29,55.24 84.29,59.05 85.18,59.94 85.31,59.94 | 85.31,59.94
N$47
  Bottom 0.406: R6.2 68.86,45.65 59.14,55.37 59.14,56.89 57.62,58.41 IC1.23
N$48
  Bottom 0.406: IC1.2 67.53,67.18 67.53,72.26 63.21,76.58 R4.2
N$49
  Bottom 0.406: IC1.4 63.97,67.94 63.97,73.02 R3.2
N$50
  Bottom 0.406: R7.2 70.32,47.94 65.56,52.7 65.56,54.61 63.02,57.15 62.06,57.15 IC1.24
N$51
  Bottom 0.406: 70.07,50.67 R8.2 66.51,53.97 66.51,55.24 63.21,58.54 62.95,58.54 IC1.25
N$52
  Bottom 0.406: IC1.26 65.75,58.8 65.75,58.54 67.78,56.51 67.78,55.24 R9.2
N$53
  Bottom 0.406: S9.1 83.27,20.19 79.46,24 79.46,31.87 R13.2 77.94,34.92 77.94,45.08 R6.1
N$54
  Bottom 0.406: S10.1 83.62,29.52 83.66,29.52 83.66,31.74 R12.2 79.21,36.19 79.21,40 81.75,42.54 81.75,46.35 R7.1
N$55
  Bottom 0.406: R11.2 82.7,39.68 83.62,39.68 | R8.1 83.02,47.62 85.56,47.62 85.56,40 85.24,39.68 83.62,39.68 | 83.62,39.68 S11.1
N$56
  Bottom 0.406: R10.2 R9.1 83.34,49.84 83.62,49.84 | 83.62,49.84 83.66,49.84 | S12.1 83.62,49.84
N$57
  Bottom 0.406: IC1.3 64.99,67.18 64.99,73.78 63.21,75.56 58.89,75.56 JP1.1 LED9.K 58.89,69.21 R16.1
N$58
  Bottom 0.406: IC1.5 58.89,67.94 58,67.94 55.08,70.86 55.08,75.56 53.3,77.34 36.54,77.34 33.49,74.29 25.49,74.29 25.49,76.45 24.22,77.72 12.79,77.72 8.09,73.02 8.09,65.78 19.01,65.78 21.42,61.84 Q3.2
N$59
  Bottom 0.406: IC1.6 57.87,66.8 57.62,67.18 54.06,70.73 54.06,74.8 52.54,76.32 39.08,76.32 32.73,69.97 S13.3
N$60
  Bottom 0.406: IC1.11 44.41,66.92 43.9,66.92 42.89,67.94 41.87,67.94 41.11,67.18 41.11,66.16 36.79,61.84 33.49,61.84 32.73,61.08 S14.3
N$61
  Bottom 0.406: LED9.A R14.1
N$62
  Bottom 0.813: K8.COM 66.43,10.03 77.81,10.03 81.24,6.6 83.27,6.6 85.43,4.44 X9.2
N$63
  Bottom 0.813: K7.COM 52.24,20.7 59.27,20.7 68.03,11.93 79.59,11.93 83.02,8.5 85.81,8.5 88.23,6.09 88.23,2.15 87.97,1.9 75.65,1.9 75.4,2.15 75.4,4.44 X8.2
N$64
  Bottom 0.813: K6.COM 48.09,13.12 48.09,10.66 49.75,9.01 53.56,9.01 54.83,7.74 58,7.74 59.4,6.34 62.19,6.34 64.1,4.44 X7.2 65.62,4.44
N$65
  Bottom 0.813: K5.COM 37.55,16.05 37.55,10.92 39.2,10.92 40.73,9.39 40.73,9.27 43.4,9.27 44.79,7.87 46.95,7.87 48.6,6.22 51.52,6.22 53.3,4.44 X6.2
N$66
  Bottom 0.813: K4.COM 29.68,16.3 29.68,9.77 30.06,9.39 33.11,9.39 34.63,7.87 37.55,7.87 39.08,6.34 41.62,6.34 43.52,4.44 X5.2
N$67
  Bottom 0.813: K3.COM 22.19,16.17 22.19,10.03 24.35,7.87 26.89,7.87 28.41,6.34 31.2,6.34 33.11,4.44 X4.2
N$68
  Bottom 0.813: K2.COM 14.44,16.3 14.44,8.63 15.2,7.87 16.85,7.87 18.38,6.34 21.17,6.34 23.2,4.31 24.94,4.31 | 24.94,4.31 24.98,4.31 | 24.94,4.31 X3.2
N$69
  Bottom 0.813: K1.COM 6.95,16.17 6.95,8 8.6,6.34 10.5,6.34 12.41,4.44 X2.2 14.69,4.44
N$70
  Bottom 0.813: K8.NO 57.83,11.17 62.32,11.17 65.24,8.25 75.02,8.25 78.83,4.44 X9.1 80.86,4.44
N$71
  Bottom 0.813: K7.NO 50.68,10.66 54.32,10.66 55.71,9.27 59.02,9.27 60.29,8 63.08,8 64.61,6.47 67.27,6.47 69.3,4.44 X8.1 70.7,4.44
N$72
  Bottom 0.813: K6.NO 42.68,11.04 44.16,11.04 45.94,9.27 47.71,9.27 49.37,7.62 52.67,7.62 54.06,6.22 56.73,6.22 58.51,4.44 X7.1
N$73
  Bottom 0.813: K5.NO 35.01,11.09 35.01,9.52 35.14,9.39 38.19,9.39 39.71,7.87 42.51,7.87 44.03,6.34 46.19,6.34 48.09,4.44 X6.1
N$74
  Bottom 0.813: K4.NO 27.39,11.09 27.39,9.65 29.04,8 29.04,7.87 32.35,7.87 33.87,6.34 36.41,6.34 38.32,4.44 X5.1
N$75
  Bottom 0.813: K3.NO 19.77,11.09 19.77,8 21.68,8 23.33,6.34 26,6.34 27.77,4.57 27.77,4.44 X4.1 30.06,4.44
N$76
  Bottom 0.813: K2.NO 12.03,11.09 12.03,8.63 14.31,6.34 15.96,6.34 17.87,4.44 X3.1
N$77
  Bottom 0.813: K1.NO 4.28,10.96 4.28,8.25 8.09,4.44 X2.1
N$78
  Bottom 0.406: 39.84,29.96 39.84,29.84 | K5.1 39.84,29.96 | IC2.15 39.84,32.38 39.84,29.96
N$79  (via drill 0.8)
  other vias: 51.27,42.54
N$80  (via drill 0.8)
  other vias: 51.27,37.46
N$81
  Bottom 0.406: IC1.1 69.69,67.94 69.69,71.43 71.27,73.02 77.3,73.02 78.89,74.61 79.84,74.61 80.8,73.66 80.8,69.21 75.08,69.21 73.81,70.48 72.22,70.48 71.59,69.84 71.59,68.57 72.22,67.94 73.5,67.94 74.45,66.99 74.45,63.18 76.99,60.64 80.16,60.64 81.11,59.69 81.11,58.41 80.16,57.46 75.4,57.46 75.4,32.38 76.67,31.11 76.67,24.76 74.13,24.76 74.13,22.22 SV1.5
N$82  (via drill 0.8)
  other vias: 62.7,33.65
N$83
  Bottom 0.406: SV1.10 77.94,18.41 77.94,32.38 76.67,33.65 76.67,56.51 80.48,56.51 82.13,58.16 82.13,59.94 80.48,61.59 77.3,61.59 77.3,65.4 73.5,69.21 R16.2
N$84  (via drill 0.8)
  other vias: 68.41,33.65
N$85
  pour Bottom (isolate 0.61): 0.47,79.37 99.53,79.37 99.53,0.63 91.91,0.63 91.91,9.52 89.37,12.06 83.02,12.06 81.75,14.6 70.32,14.6 60.16,24.76 0.47,24.76
VCC
  Bottom 0.406: 53.43,55.88 54.32,54.99 S2.1 54.7,54.48 54.83,54.48 60.92,49.65 63.65,49.65 69.5,43.81 74.13,43.81 | 53.43,55.88 53.11,56.19 | 53.11,56.19 51.14,58.16 | 51.14,58.16 50.51,58.8 IC1.20 | S3.1 47.97,54.99 51.14,58.16 | 53.43,55.88 50,52.45 42.89,52.45 40.86,54.48 40.35,54.48 S4.1 38.82,54.48 37.55,53.21 34.51,53.21 33.24,54.48 32.73,54.48 S5.1 31.2,54.48 28.41,51.68 12.66,51.68 9.87,54.48 S8.1 9.87,54.99 10.38,54.99 11.39,56 14.95,56 15.08,55.88 | 15.08,55.88 15.96,54.99 S7.1 | 15.08,55.88 15.2,56 20.54,56 21.55,54.99 23.58,54.99 S6.1 25.49,56.13 25.49,65.27 22.44,68.19 22.31,68.45 22.06,68.7 C3.+ 21.81,69.97 21.81,71.5 19.77,73.53 IC4.OUT | IC1.7 55.08,63.62 58.89,63.62 58.89,63.5 | 58.89,63.5 58.89,58.29 61.94,55.24 S1.1 62.42,54.25 68.73,47.94 68.73,46.98 69.37,46.35 74.13,46.35 | 74.13,43.81 74.13,46.35 | 74.13,46.35 74.13,55.24 | 74.13,55.24 74.13,55.49 | 53.11,56.19 53.05,56.13 52.67,56.51 C5.1 | R5.1 D2.C R14.2 71.59,71.75 70.64,70.8 70.64,68.26 71.59,67.3 71.59,65.27 69.69,63.37 69.69,63.5 58.89,63.5 | 74.13,43.81 74.13,37.46 R11.1 R12.1 R13.1 75.4,27.3 SV1.2 | R1.A 74.13,59.05 74.13,55.24 | 74.13,55.24 R10.1
(copper drawn outside any net)
  shapes: Bottom circle x2